# Altium schematic sheet İŞLEMCİ.SchDoc
size A3; CheckedBy: TEKNOFEST; SheetNumber: 1; SheetTotal: 2; Takım_Adı: UZİNOVA SİGMA; Kategori: Yüksek İrtifa Roket Yarışması; Proje_Adı: Özgün Aviyonik Sistem; ReleaseDate: 27.03.2023; PageSize: A3
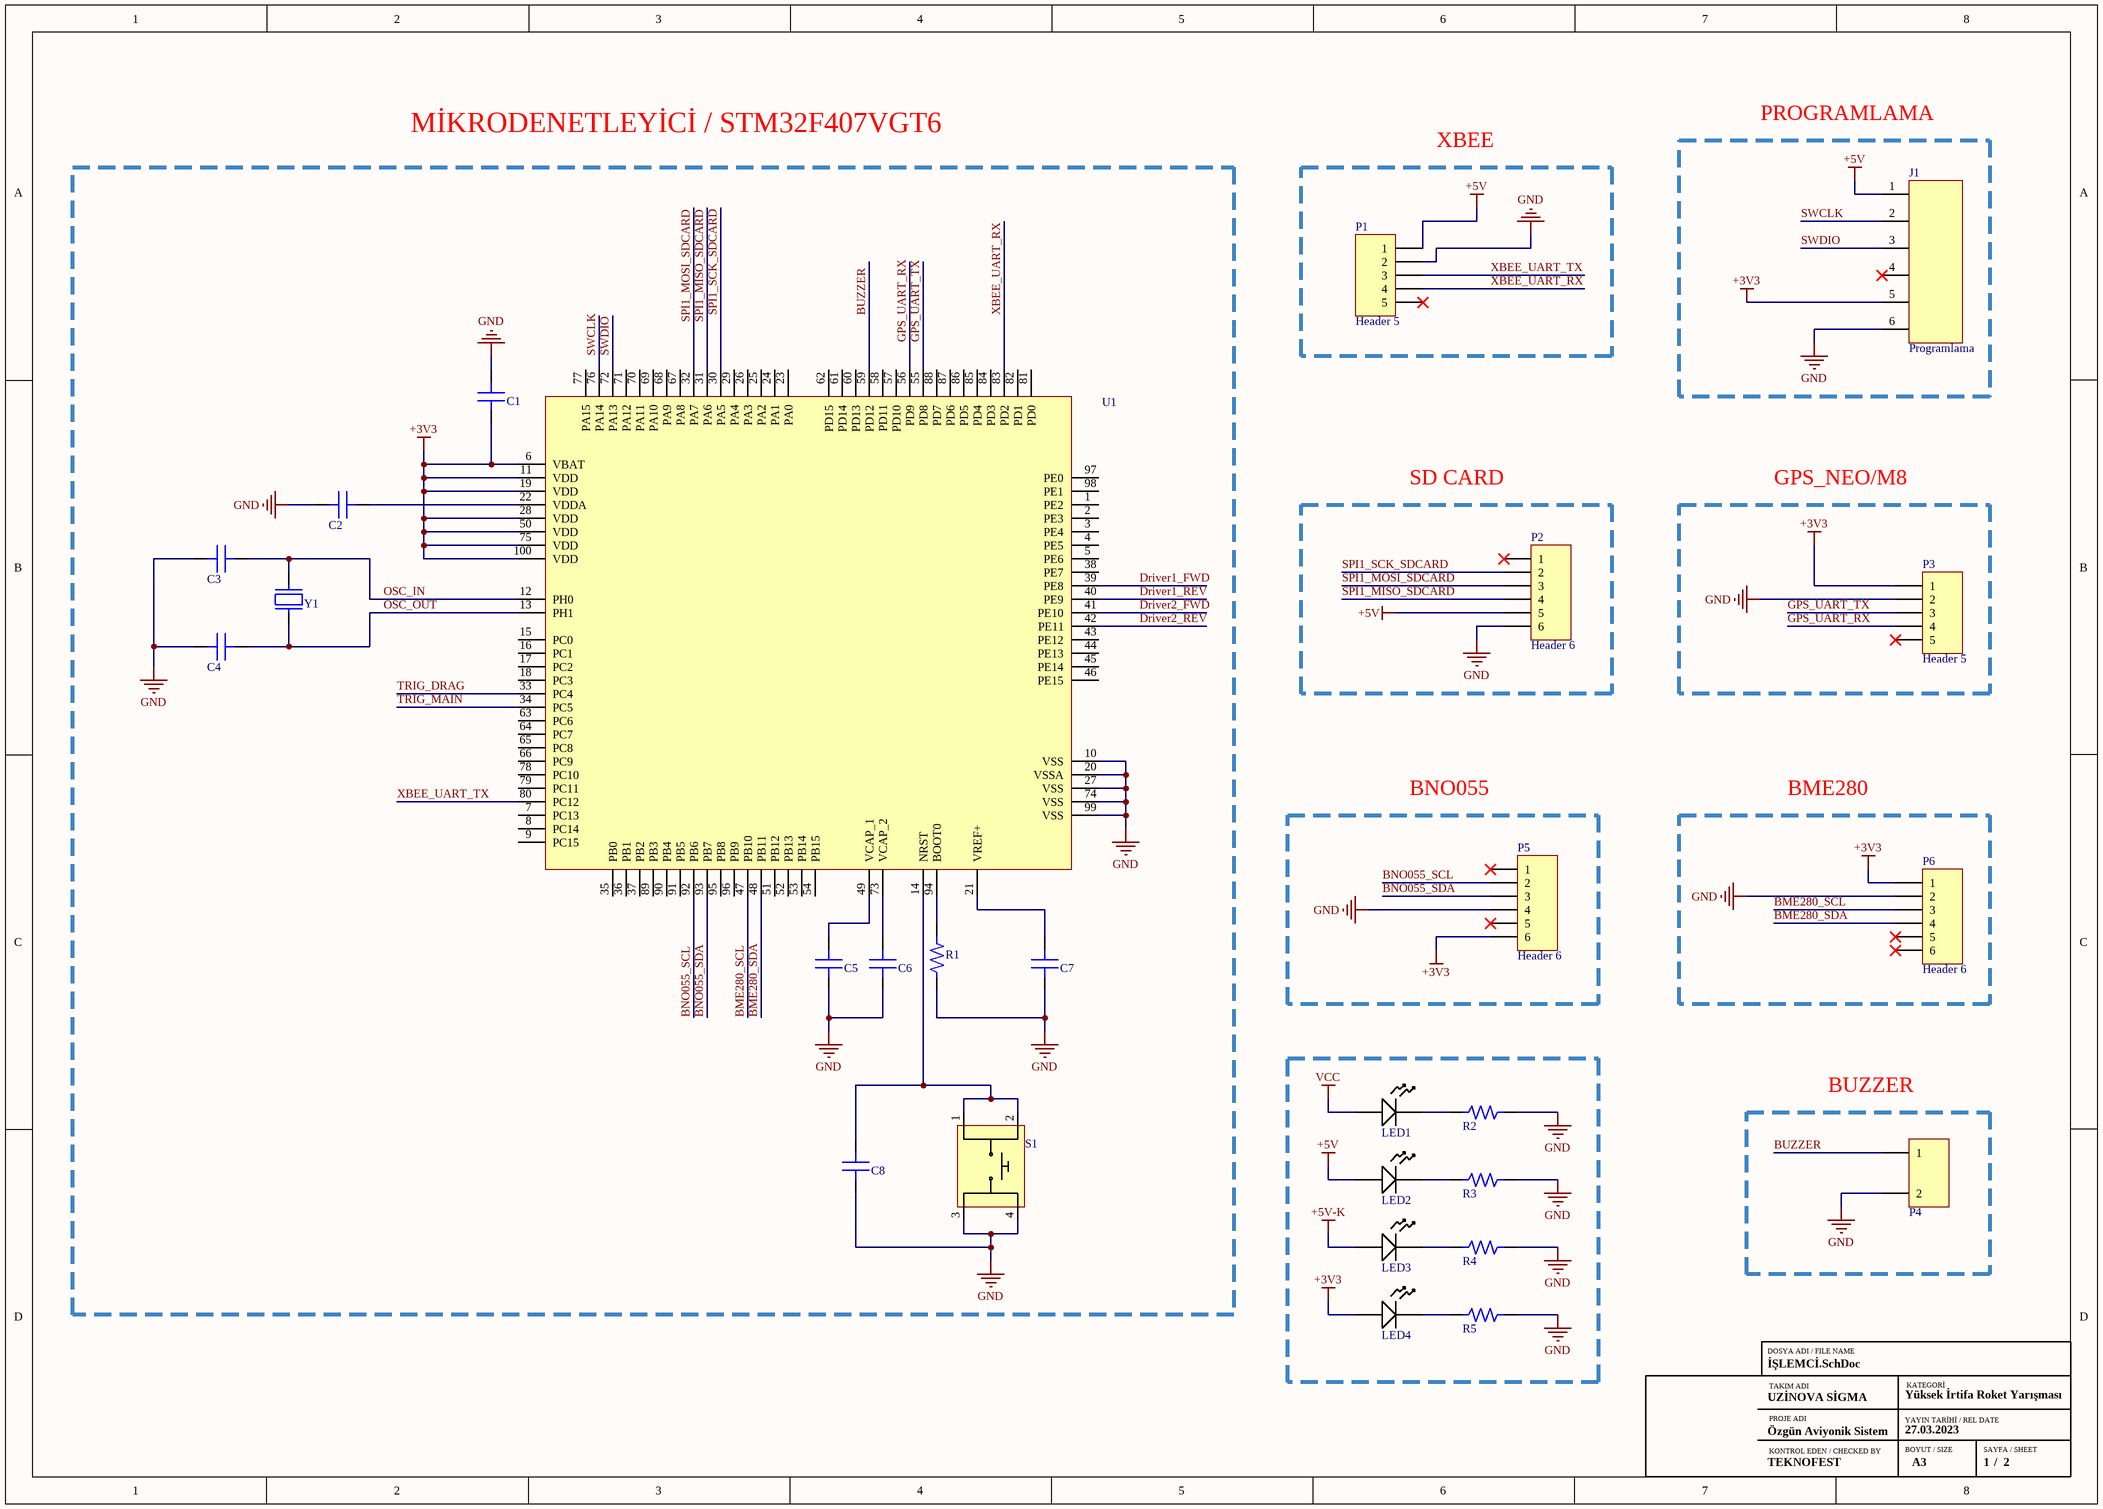
[diagram p0: İŞLEMCİ.SchDoc]

## Parts
C1  CAP CER 1uF 0805  [CAP_0805]  (value not drawn)
C2  CAP CER 10nF 0805  [CAP_0805]  (value not drawn)
C3  CAP CER 20pF 0805  [CAP_0805]  (value not drawn)
C4  CAP CER 20pF 0805  [CAP_0805]  (value not drawn)
C5  CAP CER 2.2uF 0805  [CAP_0805]  (value not drawn)
C6  CAP CER 2.2uF 0805  [CAP_0805]  (value not drawn)
C7  CAP CER 10nF 0805  [CAP_0805]  (value not drawn)
C8  CAP CER 0.1uF 0805  [CAP_0805]  (value not drawn)
J1  Programlama  [PPTC061LFBN-RC]
LED1  CMD17-21VRD/TR8  [LED RED_0805]  (value not drawn)
LED2  CMD17-21VRD/TR8  [LED RED_0805]  (value not drawn)
LED3  CMD17-21VRD/TR8  [LED RED_0805]  (value not drawn)
LED4  CMD17-21VRD/TR8  [LED RED_0805]  (value not drawn)
P1  Header 5  [HDR1X5]
P2  Header 6  [HDR1X6]
P3  Header 5  [HDR1X5]
P4  Yalancı Buzzer  [Yalancı Buzzer]  (value not drawn)
P5  Header 6  [HDR1X6]
P6  Header 6  [HDR1X6]
R1  RES 10K OHM 0805  [RES_0805]  (value not drawn)
R2  RES 470 OHM 0805  [RES_0805]  (value not drawn)
R3  RES 470 OHM 0805  [RES_0805]  (value not drawn)
R4  RES 470 OHM 0805  [RES_0805]  (value not drawn)
R5  RES 470 OHM 0805  [RES_0805]  (value not drawn)
S1  PTS815 SJG 250 SMTR LFS  [BUTTON]  (value not drawn)
U1  STM32F407VGT6  [LQFP-100]  (value not drawn)
Y1  CRYSTAL 32.7680KHZ 12.5PF SMD  [CRYSTAL_ABS05]  (value not drawn)

## Blocks framed on the sheet
XBEE: P1
PROGRAMLAMA: J1
SD CARD: P2
GPS_NEO/M8: P3
BNO055: P5
BME280: P6
BUZZER: P4

## Nets
+3V3: C1.1 J1.5 LED4.1 P3.1 P5.6 P6.1 U1.6(VBAT) U1.11(VDD) U1.19(VDD) U1.28(VDD) U1.50(VDD) U1.75(VDD) U1.100(VDD)
+5V: J1.1 LED2.1 P1.1 P2.5
+5V-K: LED3.1
GND: C1.2 C2.1 C3.1 C4.1 C5.1 C6.1 C7.1 C8.1 J1.6 P1.2 P2.6 P3.2 P4.2 P5.4 P6.2 R1.1 R2.2 R3.2 R4.2 R5.2 S1.3 S1.4 U1.10(VSS) U1.20(VSSA) U1.27(VSS) U1.74(VSS) U1.99(VSS)
VCC: LED1.1
BME280_SCL: P6.3 U1.47(PB10)
BME280_SDA: P6.4 U1.48(PB11)
BNO055_SCL: P5.2 U1.92(PB6)
BNO055_SDA: P5.3 U1.93(PB7)
BUZZER: P4.1 U1.59(PD12)
Driver1_FWD: U1.39(PE8)
Driver1_REV: U1.40(PE9)
Driver2_FWD: U1.41(PE10)
Driver2_REV: U1.42(PE11)
GPS_UART_RX: P3.4 U1.56(PD9)
GPS_UART_TX: P3.3 U1.55(PD8)
OSC_IN: C3.2 U1.12(PH0) Y1.2
OSC_OUT: C4.2 U1.13(PH1) Y1.1
SPI1_MISO_SDCARD: P2.4 U1.31(PA6)
SPI1_MOSI_SDCARD: P2.3 U1.32(PA7)
SPI1_SCK_SDCARD: P2.2 U1.30(PA5)
SWCLK: J1.2 U1.76(PA14)
SWDIO: J1.3 U1.72(PA13)
TRIG_DRAG: U1.33(PC4)
TRIG_MAIN: U1.34(PC5)
XBEE_UART_RX: P1.4 U1.83(PD2)
XBEE_UART_TX: P1.3 U1.80(PC12)
NetC2_2: C2.2 U1.22(VDDA)
NetC5_2: C5.2 U1.49(VCAP_1)
NetC6_2: C6.2 U1.73(VCAP_2)
NetC7_2: C7.2 U1.21(VREF+)
NetC8_2: C8.2 S1.1 S1.2 U1.14(NRST)
NetLED1_2: LED1.2 R2.1
NetLED2_2: LED2.2 R3.1
NetLED3_2: LED3.2 R4.1
NetLED4_2: LED4.2 R5.1
NetR1_2: R1.2 U1.94(BOOT0)

Not connected (* = marked no-connect by the designer): J1 4*; P1 5*; P2 1*; P3 5*; P5 1* 5*; P6 5* 6*; U1 1(PE2) 2(PE3) 3(PE4) 4(PE5) 5(PE6) 7(PC13) 8(PC14) 9(PC15) 15(PC0) 16(PC1) 17(PC2) 18(PC3) 23(PA0) 24(PA1) 25(PA2) 26(PA3) 29(PA4) 35(PB0) 36(PB1) 37(PB2) 38(PE7) 43(PE12) 44(PE13) 45(PE14) 46(PE15) 51(PB12) 52(PB13) 53(PB14) 54(PB15) 57(PD10) 58(PD11) 60(PD13) 61(PD14) 62(PD15) 63(PC6) 64(PC7) 65(PC8) 66(PC9) 67(PA8) 68(PA9) 69(PA10) 70(PA11) 71(PA12) 77(PA15) 78(PC10) 79(PC11) 81(PD0) 82(PD1) 84(PD3) 85(PD4) 86(PD5) 87(PD6) 88(PD7) 89(PB3) 90(PB4) 91(PB5) 95(PB8) 96(PB9) 97(PE0) 98(PE1)

## Notes on the sheet
- MİKRODENETLEYİCİ / STM32F407VGT6
- (near C7) BOOT0 ekleme yapılabilir-amerika roket
- DOSYA ADI / FILE NAME
- TAKIM ADI
- KATEGORİ
- KONTROL EDEN / CHECKED BY
- PROJE ADI
- BOYUT / SIZE
- YAYIN TARİHİ / REL DATE
- SAYFA / SHEET
- /

## Library data of the parts
LED1-LED4 = LED RED: LED Uni-Color Red 640nm 2-Pin SMT T/R; Manufacturer: VCC CHML; Power Rating: 100mW; Luminous Intensity: 6mcd; Viewing Angle: 140°; Lens Style: Diffused,Tinted,Rectangular,Colored; Forward Current: 20mA; Forward Voltage: 2V; Reverse Voltage (DC): 5V; Number of LEDs: 1; Supplier 1: Digi-Key; Manufacturer Part Number: CMD17-21VRD/TR8; RoHS: Yes; Category: LEDs; Stock 1: 357228; Pricing 1: 1=0,73000, 10=0,47800, 100=0,31310, 1000=0,24720 (USD); Mount: Surface Mount; Case/Package: 0805; Number of Pins: 2; Color: Red; Case Code (Metric): 2012; Case Code (Imperial): 0805; Lens Color: Red; Min Operating Temperature: -40°C; Max Operating Temperature: 85°C; Packaging: Tape and Reel; Package Quantity: 1; Illumination Color: Red; Test Current: 20mA; Wavelength: 640nm; Reverse Voltage: 5V; Length: 2mm; Width: 1.25mm; Height: 1.1mm; RoHS Compliant: Yes; Lead Free: Lead Free; ComponentLink1URL: http://www.mouser.com/ds/2/423/CMD1721ver1-1064576.pdf?src-supplier=Mouser; ComponentLink1Description: http://www.mouser.com/ds/2/423/CMD1721ver1-1064576.pdf?src-supplier=Mouser; ComponentLink2URL: https://www.alliedelec.com/m/d/ea8f758becbd32522d2612194452bcae.pdf?src-supplier=Allied+Electronics; ComponentLink2Description: https://www.alliedelec.com/m/d/ea8f758becbd32522d2612194452bcae.pdf?src-supplier=Allied+Electronics; ComponentLink3URL: http://www.onlinecomponents.com/productFiles/mf-CM/2cmd17-21seriessmtleds0805packagesize.pdf?src-supplier=Onlinecomponents.com; ComponentLink3Description: http://www.onlinecomponents.com/productFiles/mf-CM/2cmd17-21seriessmtleds0805packagesize.pdf?src-supplier=Onlinecomponents.com; ComponentLink4URL: https://vcclite.com/wp-content/uploads/wpallimport/files/files/CMD1721Seriesver3.pdf?src-supplier=Digi-Key; ComponentLink4Description: https://vcclite.com/wp-content/uploads/wpallimport/files/files/CMD1721Seriesver3.pdf?src-supplier=Digi-Key; Supplier Part Number 1: L62501CT-ND
P1 P3 = Header 5: Header, 5-Pin; LatestRevisionDate: 17-Jul-2002; LatestRevisionNote: Re-released for DXP Platform.; Publisher: Altium Limited
P2 P5 P6 = Header 6: Header, 6-Pin; LatestRevisionDate: 17-Jul-2002; LatestRevisionNote: Re-released for DXP Platform.; Publisher: Altium Limited
S1 = BUTTON: Switch Tactile N.O. SPST Button J-Bend 0.05A 12VDC 3.92N SMD T/R; Manufacturer: ITT C&K; Supplier 1: Digi-Key; Manufacturer Part Number: PTS815SJG250SMTRLFS; RoHS: Yes; Category: Tactile Switches; Stock 1: 47215; Pricing 1: 1=0,22000, 10=0,21400, 25=0,20280, 100=0,18360, 250=0,16736, 500=0,15558, 1000=0,13271 (USD); Supplier Part Number 1: CKN12217-1-ND
U1 = STM32F407VGT6: IC MCU 32BIT 1MB FLASH 100LQFP; Manufacturer: STMicroelectronics; Core Architecture: ARM; Interface: I2C,SPI,USB,CAN,Ethernet,IrDA,UART,USART,LIN,EBI/EMI,I2S; Data Bus Width: 32b; Max Supply Voltage: 3.6V; Min Supply Voltage: 1.8V; Number of I/Os: 82; Frequency: 168MHz; RAM Size: 196KB; Oscillator Type: Internal; Memory Size: 1024KB; Peripherals: Brown-out Detect/Reset,POR,PWM,WDT,DMA,LCD,I2C; Number of Timers/Counters: 14; Watchdog Timer: Yes; Number of ADC Channels: 16; Number of PWM Channels: 2; Number of SPI Channels: 3; Number of Ethernet Channels: 1; Supplier 1: Digi-Key; Manufacturer Part Number: STM32F407VGT6; RoHS: Yes; Category: Microcontrollers; Pricing 1: 1=16,52000, 10=15,18400, 25=14,55440, 90=12,82367, 270=12,19433, 450=11,40760 (USD); Case/Package: LQFP; Number of Pins: 100; Min Operating Temperature: -40°C; Max Operating Temperature: 85°C; Series: STM32 F4; Package Quantity: 90; Packaging: Tray; Max Frequency: 168MHz; Memory Type: FLASH; Number of Programmable I/O: 82; Number of I2C Channels: 3; Number of UART Channels: 2; Address Bus Width: 32b; Length: 14.2mm; Width: 14.2mm; Height: 1.45mm; Radiation Hardening: No; Reach SVHC Compliant: Yes; Lead Free: Lead Free; RoHS Compliant: Yes; ComponentLink1URL: https://datasheet.ciiva.com/14132/stm32f407vgt6-tds-eng-14132567.pdf?src-supplier=Distrelec; ComponentLink1Description: https://datasheet.ciiva.com/14132/stm32f407vgt6-tds-eng-14132567.pdf?src-supplier=Distrelec; ComponentLink2URL: https://datasheet.ciiva.com/4842/dm00037051-492832-4842280.pdf?src-supplier=Mouser; ComponentLink2Description: https://datasheet.ciiva.com/4842/dm00037051-492832-4842280.pdf?src-supplier=Mouser; ComponentLink3URL: https://datasheet.ciiva.com/48687/001075599-da-01-en-mcu-32bt-1mb-stm32f407vgt6-lqfp-100-stm-48687547.pdf?src-supplier=Conrad; ComponentLink3Description: https://datasheet.ciiva.com/48687/001075599-da-01-en-mcu-32bt-1mb-stm32f407vgt6-lqfp-100-stm-48687547.pdf?src-supplier=Conrad; Supplier Part Number 1: 497-11605-ND
Y1 = CRYSTAL: Crystal 0.032768MHz ±20ppm (Tol) 12.5pF Flexural 90000Ohm 2-Pin CSMD T/R; Manufacturer: Abracon; Manufacturer Part Number: ABS05-32.768KHZ-T; Frequency: 32.768kHz; ESR (Equivalent Series Resistance): 90kR; Operating Frequency: 32.768 kHz; Supplier 1: Digi-Key; RoHS: Yes; Category: Crystals; Stock 1: 376220; Pricing 1: 1=0,66000, 10=0,58100, 50=0,54340, 100=0,48020, 500=0,45494, 1000=0,37911 (USD); Mount: Surface Mount; Case/Package: CSMD; Number of Pins: 2; Min Operating Temperature: -40°C; Max Operating Temperature: 85°C; Packaging: Tape and Reel; Frequency Tolerance: 20ppm; Load Capacitance: 12.5pF; Package Quantity: 3000; Tolerance: 20ppm; Termination: SMD/SMT; Series Resistance: 90kR; Series: ABS05; Length: 1.6mm; Width: 1mm; Height: 0.5mm; Depth: 1mm; Radiation Hardening: No; Reach SVHC Compliant: Yes; Lead Free: Lead Free; RoHS Compliant: Yes; ComponentLink1URL: https://datasheet.ciiva.com/23810/abs05-23810480.pdf?src-supplier=Newark; ComponentLink1Description: https://datasheet.ciiva.com/23810/abs05-23810480.pdf?src-supplier=Newark; ComponentLink2URL: https://datasheet.ciiva.com/6728/abs05-6728949.pdf?src-supplier=Digi-Key; ComponentLink2Description: https://datasheet.ciiva.com/6728/abs05-6728949.pdf?src-supplier=Digi-Key; ComponentLink3URL: https://datasheet.ciiva.com/6728/abs05-6728950.pdf?src-supplier=Digi-Key; ComponentLink3Description: https://datasheet.ciiva.com/6728/abs05-6728950.pdf?src-supplier=Digi-Key; ComponentLink4URL: https://datasheet.ciiva.com/16411/abs05-16411149.pdf?src-supplier=Future+Electronics; ComponentLink4Description: https://datasheet.ciiva.com/16411/abs05-16411149.pdf?src-supplier=Future+Electronics; Supplier Part Number 1: 535-11899-1-ND